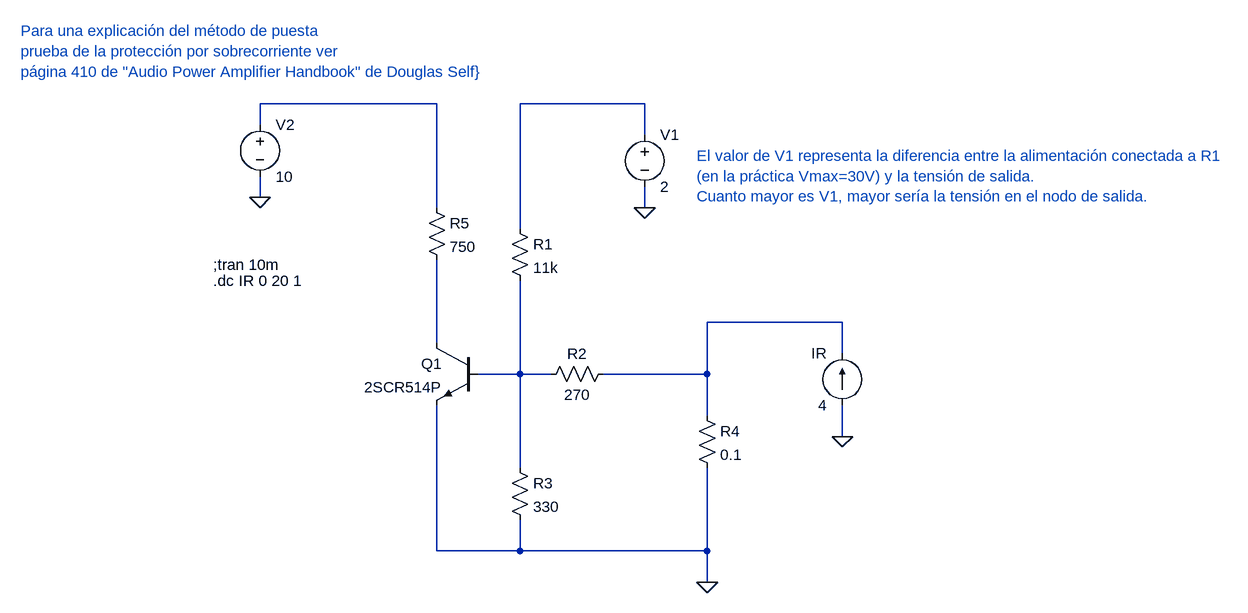
[diagram p0: schematic test_proteccion_sobrecorriente.asc]
test_proteccion_sobrecorriente.asc, the LTspice schematic file:
Version 4
SHEET 1 1384 712
WIRE 128 -176 -144 -176
WIRE 448 -176 256 -176
WIRE -144 -144 -144 -176
WIRE 448 -128 448 -176
WIRE -144 -32 -144 -64
WIRE 128 -16 128 -176
WIRE 448 -16 448 -48
WIRE 256 16 256 -176
WIRE 752 160 544 160
WIRE 128 192 128 64
WIRE 752 208 752 160
WIRE 256 240 256 96
WIRE 256 240 192 240
WIRE 304 240 256 240
WIRE 544 240 544 160
WIRE 544 240 384 240
WIRE 544 304 544 240
WIRE 752 336 752 288
WIRE 256 384 256 240
WIRE 128 512 128 288
WIRE 256 512 256 464
WIRE 256 512 128 512
WIRE 544 512 544 384
WIRE 544 512 256 512
WIRE 544 560 544 512
FLAG 544 560 0
FLAG 448 -16 0
FLAG -144 -32 0
FLAG 752 336 0
SYMBOL npn 192 192 M0
SYMATTR InstName Q1
SYMATTR Value 2SCR514P
SYMBOL res 400 224 R90
WINDOW 0 0 56 VBottom 2
WINDOW 3 32 56 VTop 2
SYMATTR InstName R2
SYMATTR Value 270
SYMBOL res 240 368 R0
SYMATTR InstName R3
SYMATTR Value 330
SYMBOL res 528 288 R0
SYMATTR InstName R4
SYMATTR Value 0.1
SYMBOL voltage 448 -144 R0
WINDOW 123 0 0 Left 0
WINDOW 39 0 0 Left 0
SYMATTR InstName V1
SYMATTR Value 2
SYMBOL voltage -144 -160 R0
WINDOW 123 0 0 Left 0
WINDOW 39 0 0 Left 0
SYMATTR InstName V2
SYMATTR Value 10
SYMBOL current 752 288 R180
WINDOW 0 24 80 Left 2
WINDOW 3 24 0 Left 2
WINDOW 123 0 0 Left 0
WINDOW 39 0 0 Left 0
SYMATTR InstName IR
SYMATTR Value 4
SYMBOL res 112 -32 R0
SYMATTR InstName R5
SYMATTR Value 750
SYMBOL res 240 0 R0
SYMATTR InstName R1
SYMATTR Value 11k
TEXT -216 72 Left 2 !;tran 10m
TEXT -216 96 Left 2 !.dc IR 0 20 1
TEXT -512 -288 Left 2 ;Para una explicación del método de puesta\nprueba de la protección por sobrecorriente ver\npágina 410 de "Audio Power Amplifier Handbook" de Douglas Self}
TEXT 528 -96 Left 2 ;El valor de V1 representa la diferencia entre la alimentación conectada a R1\n(en la práctica Vmax=30V) y la tensión de salida. \nCuanto mayor es V1, mayor sería la tensión en el nodo de salida.

The netlist it stands for:
* test_proteccion_sobrecorriente.asc
Q1 N004 N005 0 0 2SCR514P
R2 N003 N005 270
R3 N005 0 330
R4 N003 0 0.1
V1 N002 0 2
V2 N001 0 10
IR 0 N003 4
R5 N001 N004 750
R1 N002 N005 11k
.model NPN NPN
.model PNP PNP
.lib standard.bjt
;tran 10m
.dc IR 0 20 1
* Para una explicación del método de puesta
* prueba de la protección por sobrecorriente ver
* página 410 de "Audio Power Amplifier Handbook" de Douglas Self}
* El valor de V1 representa la diferencia entre la alimentación conectada a R1
* (en la práctica Vmax=30V) y la tensión de salida.
* Cuanto mayor es V1, mayor sería la tensión en el nodo de salida.
.backanno
.end